# Altium schematic sheet lcd_pin.SchDoc
size A
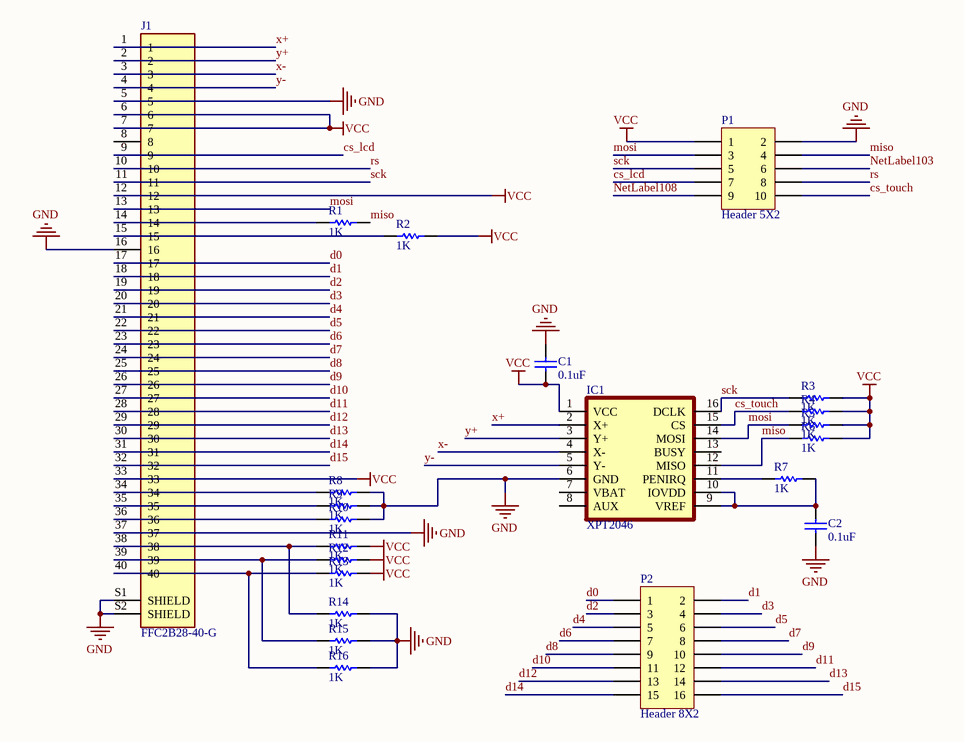
[diagram p0: lcd_pin.SchDoc]

## Parts
C1  0.1uF  [CAPC4817X12N]
C2  0.1uF  [CAPC4817X12N]
IC1  XPT2046  [TSSOP16]
J1  FFC2B28-40-G  [GCT_FFC2B28-40-G]
P1  Header 5X2  [HDR2X5]
P2  Header 8X2  [HDR2X8]
R1  1K  [RESC4817X04N]
R2  1K  [RESC4817X04N]
R3  1K  [RESC4817X04N]
R4  1K  [RESC4817X04N]
R5  1K  [RESC4817X04N]
R6  1K  [RESC4817X04N]
R7  1K  [RESC4817X04N]
R8  1K  [RESC4817X04N]
R9  1K  [RESC4817X04N]
R10  1K  [RESC4817X04N]
R11  1K  [RESC4817X04N]
R12  1K  [RESC4817X04N]
R13  1K  [RESC4817X04N]
R14  1K  [RESC4817X04N]
R15  1K  [RESC4817X04N]
R16  1K  [RESC4817X04N]

## Nets
GND: C1.2 C2.1 IC1.6(GND) J1.5 J1.16 J1.37 J1.S1(SHIELD) J1.S2(SHIELD) P1.2 R8.2 R9.2 R10.2 R14.2 R15.2 R16.2
VCC: C1.1 IC1.1(VCC) J1.6 J1.7 J1.12 J1.33 P1.1 R2.2 R3.2 R4.2 R5.2 R6.2 R11.2 R12.2 R13.2
cs_lcd: J1.9 P1.7
cs_touch: IC1.15(CS) P1.10 R4.1
d0: J1.17 P2.1
d1: J1.18 P2.2
d2: J1.19 P2.3
d3: J1.20 P2.4
d4: J1.21 P2.5
d5: J1.22 P2.6
d6: J1.23 P2.7
d7: J1.24 P2.8
d8: J1.25 P2.9
d9: J1.26 P2.10
d10: J1.27 P2.11
d11: J1.28 P2.12
d12: J1.29 P2.13
d13: J1.30 P2.14
d14: J1.31 P2.15
d15: J1.32 P2.16
miso: IC1.12(MISO) P1.4 R1.2 R6.1
mosi: IC1.14(MOSI) J1.13 P1.3 R5.1
NetLabel103: P1.6
NetLabel108: P1.9
rs: J1.10 P1.8
sck: IC1.16(DCLK) J1.11 P1.5 R3.1
x+: IC1.2(X+) J1.1
x-: IC1.4(X-) J1.3
y+: IC1.3(Y+) J1.2
y-: IC1.5(Y-) J1.4
NetC2_2: C2.2 IC1.9(VREF) IC1.10(IOVDD) R7.2
NetIC1_11: IC1.11(PENIRQ) R7.1
NetJ1_14: J1.14 R1.1
NetJ1_15: J1.15 R2.1
NetJ1_34: J1.34 R8.1
NetJ1_35: J1.35 R9.1
NetJ1_36: J1.36 R10.1
NetJ1_38: J1.38 R11.1 R14.1
NetJ1_39: J1.39 R12.1 R15.1
NetJ1_40: J1.40 R13.1 R16.1

Not connected (* = marked no-connect by the designer): IC1 7(VBAT) 8(AUX) 13(BUSY); J1 8

## Library data of the parts
C1 C2 = CAP SMD 1206: CAP 1206; Designer: Abbas Basereh; Desc.: CAP SMD 1206; Data: 16-12-2016
IC1 = XPT2046: RASPBERRY PI 3.5 TFT DISPLAY; MF: Xptek; Package: Package; Price: None; Value: *; SnapEDA_Link: https://www.snapeda.com/parts/XPT2046/Xptek/view-part/?ref=snap; MP: XPT2046; Availability: Not in stock; Check_prices: https://www.snapeda.com/parts/XPT2046/Xptek/view-part/?ref=eda
J1 = FFC2B28-40-G: 40 Position FFC, FPC Connector Contacts, Top and Bottom 0.020 _0.50mm_ Surface Mount, Right Angle; MF: Global Connector Technology; Value: *; MP: FFC2B28-40-G; Package: Package Analog Devices; Price: None; Availability: Unavailable; SnapEDA_Link: https://www.snapeda.com/parts/FFC2B28-40-G/Global%20Connector%20Technology/view-part/4223068/?ref=snap
P1 = Header 5X2: Header, 5-Pin, Dual row; LatestRevisionDate: 17-Jul-2002; LatestRevisionNote: Re-released for DXP Platform.; Publisher: Altium Limited
P2 = Header 8X2: Header, 8-Pin, Dual row; LatestRevisionDate: 17-Jul-2002; LatestRevisionNote: Re-released for DXP Platform.; Publisher: Altium Limited
R1-R16 = RES 1206 0.25W: RES 1206; Designer: Abbas Basereh; Desc.: RES SMD 1206; Data: 16-12-2016